# Altium schematic sheet som_fpga.SchDoc
size 420 x 297 mm
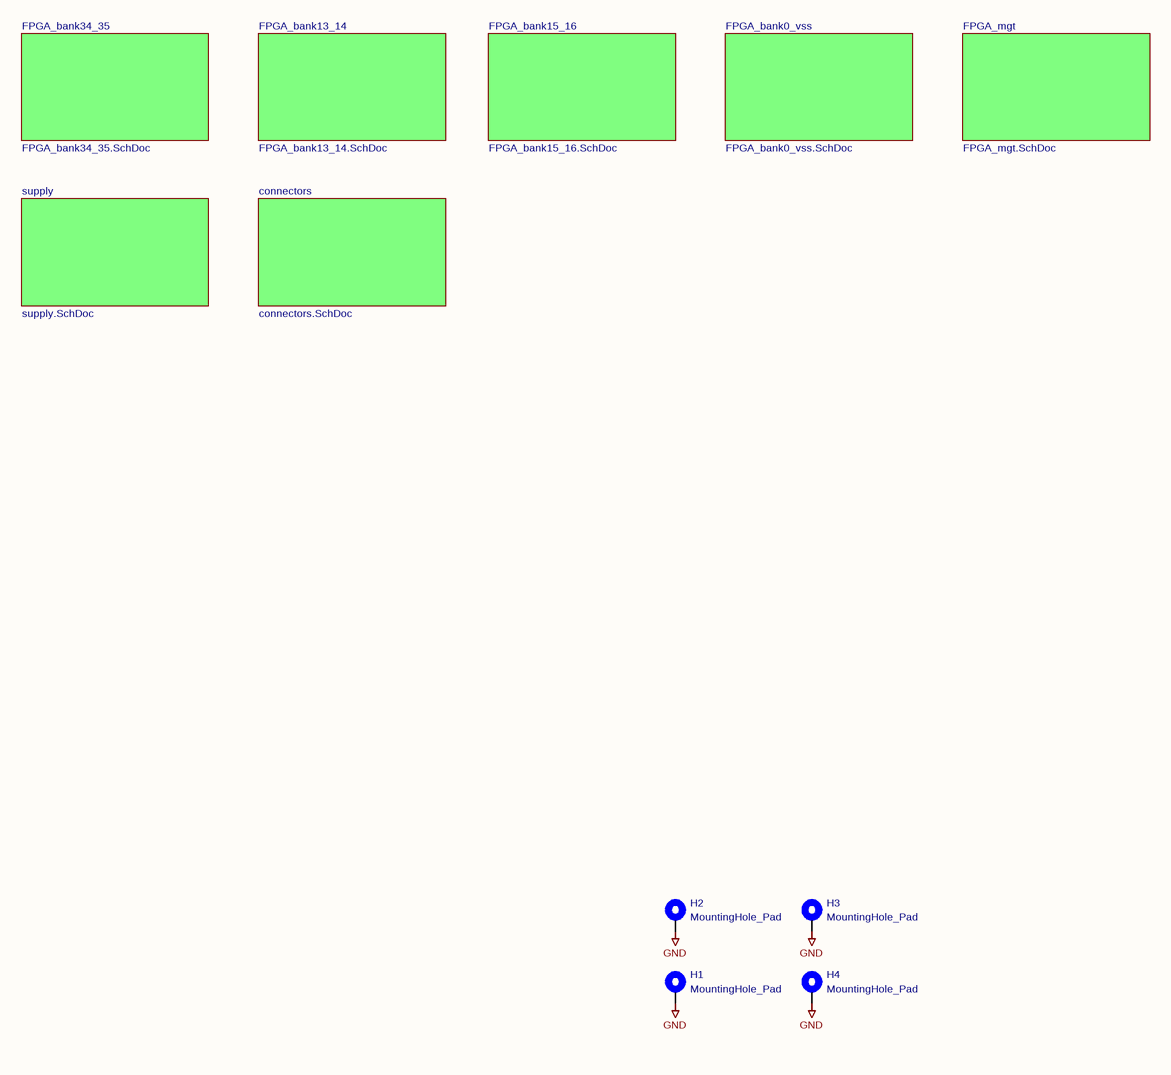
[diagram p0: som_fpga.SchDoc]

## Parts
H1  MountingHole_Pad  [MountingHole_3.2mm_M3_ISO7380_Pad]  (no BOM)
H2  MountingHole_Pad  [MountingHole_3.2mm_M3_ISO7380_Pad]  (no BOM)
H3  MountingHole_Pad  [MountingHole_3.2mm_M3_ISO7380_Pad]  (no BOM)
H4  MountingHole_Pad  [MountingHole_3.2mm_M3_ISO7380_Pad]  (no BOM)

## Sub-sheets
connectors = connectors.SchDoc: no entries
FPGA_bank0_vss = FPGA_bank0_vss.SchDoc: no entries
FPGA_bank13_14 = FPGA_bank13_14.SchDoc: no entries
FPGA_bank15_16 = FPGA_bank15_16.SchDoc: no entries
FPGA_bank34_35 = FPGA_bank34_35.SchDoc: no entries
FPGA_mgt = FPGA_mgt.SchDoc: no entries
supply = supply.SchDoc: no entries

## Nets
GND: H1.1 H2.1 H3.1 H4.1

## Notes on the sheet
- 1
- 2
- 3
- 4
- 5
- 6
- 7
- 8
- A
- B
- C
- D
- E
- Title:
- File: som_fpga.kicad_sch
- Sheet: /
- F
- KiCad E.D.A.  kicad (5.1.4)-1
- Size: A3
- Date:
- Rev:
- Id: 1/1

## Library data of the parts
H1-H4 = MountingHole_Pad: Value: MountingHole_Pad; Footprint: MountingHole:MountingHole_3.2mm_M3_ISO7380_Pad